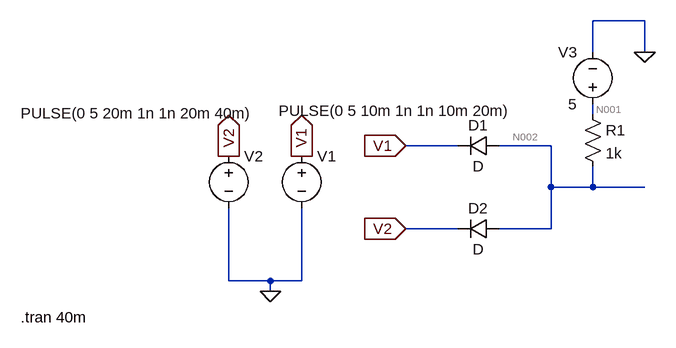
[diagram p0: schematic AND_Gate.asc]
AND_Gate.asc, the LTspice schematic file:
Version 4
SHEET 1 880 680
WIRE 16 -224 -64 -224
WIRE -64 -176 -64 -224
WIRE 16 -176 16 -224
WIRE -64 -80 -64 -96
WIRE -272 -32 -352 -32
WIRE -128 -32 -208 -32
WIRE -128 32 -128 -32
WIRE -64 32 -64 0
WIRE -64 32 -128 32
WIRE 16 32 -64 32
WIRE -272 96 -352 96
WIRE -128 96 -128 32
WIRE -128 96 -208 96
WIRE -624 176 -624 64
WIRE -560 176 -624 176
WIRE -512 176 -512 64
WIRE -512 176 -560 176
WIRE -560 192 -560 176
FLAG -352 -32 V1
IOPIN -352 -32 In
FLAG -352 96 V2
IOPIN -352 96 In
FLAG -512 -16 V1
IOPIN -512 -16 Out
FLAG -624 -16 V2
IOPIN -624 -16 Out
FLAG -560 192 0
FLAG 16 -176 0
SYMBOL voltage -512 -32 R0
WINDOW 3 -35 -54 Left 2
WINDOW 123 0 0 Left 0
WINDOW 39 0 0 Left 0
SYMATTR Value PULSE(0 5 10m 1n 1n 10m 20m)
SYMATTR InstName V1
SYMBOL voltage -624 -32 R0
WINDOW 3 -320 -50 Left 2
WINDOW 123 0 0 Left 0
WINDOW 39 0 0 Left 0
SYMATTR Value PULSE(0 5 20m 1n 1n 20m 40m)
SYMATTR InstName V2
SYMBOL diode -208 -48 R90
WINDOW 0 0 32 VBottom 2
WINDOW 3 32 32 VTop 2
SYMATTR InstName D1
SYMBOL diode -208 80 R90
WINDOW 0 0 32 VBottom 2
WINDOW 3 32 32 VTop 2
SYMATTR InstName D2
SYMBOL res -80 -96 R0
SYMATTR InstName R1
SYMATTR Value 1k
SYMBOL voltage -64 -80 R180
WINDOW 0 24 96 Left 2
WINDOW 3 24 16 Left 2
WINDOW 123 0 0 Left 0
WINDOW 39 0 0 Left 0
SYMATTR InstName V3
SYMATTR Value 5
TEXT -944 232 Left 2 !.tran 40m

The netlist it stands for:
* AND_Gate.asc
V1 V1 0 PULSE(0 5 10m 1n 1n 10m 20m)
V2 V2 0 PULSE(0 5 20m 1n 1n 20m 40m)
D1 N002 V1 D
D2 N002 V2 D
R1 N001 N002 1k
V3 N001 0 5
.model D D
.lib standard.dio
.tran 40m
.backanno
.end

* Results of the author's LTspice run, read from the files saved beside the schematic
* Operating Point, zero values left out:
*   V(n002) = 675.1 mV
*   V(n001) = 5 V
*   I(D2) = 2.163 mA
*   I(D1) = 2.163 mA
*   I(R1) = 4.325 mA
*   I(V3) = -4.325 mA
*   I(V2) = 2.162 mA
*   I(V1) = 2.162 mA
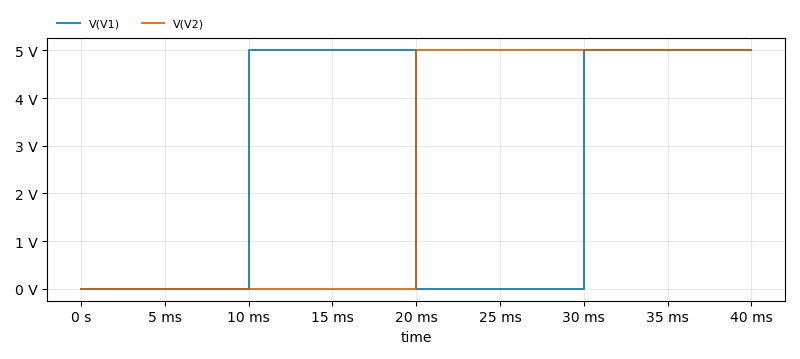
[diagram p1: Transient Analysis of AND_Gate.asc, plotted from the saved traces]
* Transient Analysis, 1 run:
*   V(V1): min 0 V, max 5 V, average 2.5 V, rms 3.536 V, last 5 V
*   V(V2): min 0 V, max 5 V, average 2.5 V, rms 3.536 V, last 5 V